# Altium schematic sheet DIO_buffer.schdoc
size 420 x 297 mm; EDA_Number: ARTIQ; Author: G.Kasprowicz; CompanyName: WUT ISE; DrawnBy: G.Kasprowicz; Organization: WUT ISE; DocumentNumber: 11; SheetNumber: 11; ModifiedBy: -; CheckedDate: -; Title2: DIO buffers; Designer: G.Kasprowicz; ModifiedDate: -; ProjectName: Sensor Box
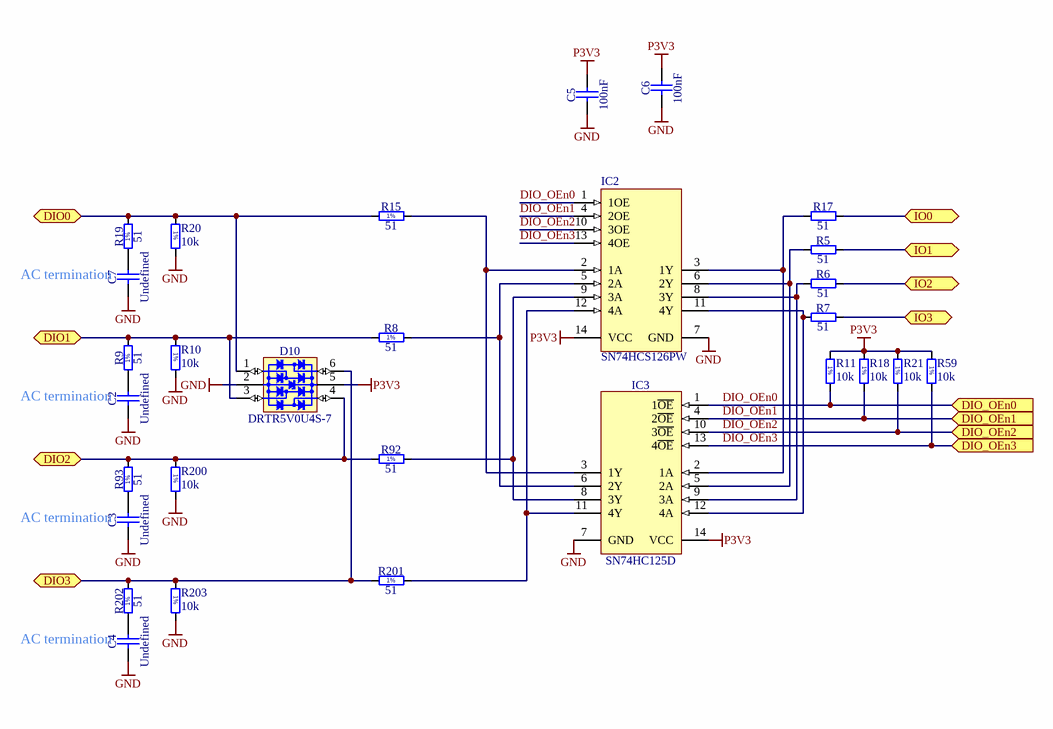
[diagram p0: DIO_buffer.schdoc]

## Parts
C2  Undefined  [CAPC1608X90N]
C3  Undefined  [CAPC1608X90N]
C4  Undefined  [CAPC1608X90N]
C5  100nF  [CAPC1005X55N]
C6  100nF  [CAPC1005X55N]
C7  Undefined  [CAPC1608X90N]
D10  DRTR5V0U4S-7  [SOT65P210X110-6N]
IC2  SN74HCS126PW  [SOP65P640X120-14N]
IC3  SN74HC125D  [SOIC127P600X175-14N]
R5  51  [RESC1005X40N]
R6  51  [RESC1005X40N]
R7  51  [RESC1005X40N]
R8  51  [RESC1005X40N]
R9  51  [RESC1005X40N]
R10  10k  [RESC1005X40N]
R11  10k  [RESC1005X40N]
R15  51  [RESC1005X40N]
R17  51  [RESC1005X40N]
R18  10k  [RESC1005X40N]
R19  51  [RESC1005X40N]
R20  10k  [RESC1005X40N]
R21  10k  [RESC1005X40N]
R59  10k  [RESC1005X40N]
R92  51  [RESC1005X40N]
R93  51  [RESC1005X40N]
R200  10k  [RESC1005X40N]
R201  51  [RESC1005X40N]
R202  51  [RESC1005X40N]
R203  10k  [RESC1005X40N]

## Ports
DIO0 (bidir), DIO1 (bidir), DIO2 (bidir), DIO3 (bidir), DIO_OEn0 (in), DIO_OEn1 (in), DIO_OEn2 (in), DIO_OEn3 (in), IO0 (bidir), IO1 (bidir), IO2 (bidir), IO3 (bidir)

## Nets
GND: C2.1 C3.1 C4.1 C5.1 C6.1 C7.1 D10.2(GND) IC2.7(GND) IC3.7(GND) R10.2 R20.2 R200.2 R203.2
P3V3: C5.2 C6.2 D10.5(VBUS) IC2.14(VCC) IC3.14(VCC) R11.1 R18.1 R21.1 R59.1
DIO0: D10.1(I/O1) R15.1 R19.2 R20.1 ; port DIO0
DIO1: D10.3(I/O2) R8.1 R9.2 R10.1 ; port DIO1
DIO2: D10.4(I/O3) R92.1 R93.2 R200.1 ; port DIO2
DIO3: D10.6(I/O4) R201.1 R202.2 R203.1 ; port DIO3
DIO_OEn0: IC2.1(1OE) IC3.1(1~{OE}) R11.2 ; port DIO_OEn0
DIO_OEn1: IC2.4(2OE) IC3.4(2~{OE}) R18.2 ; port DIO_OEn1
DIO_OEn2: IC2.10(3OE) IC3.10(3~{OE}) R21.2 ; port DIO_OEn2
DIO_OEn3: IC2.13(4OE) IC3.13(4~{OE}) R59.2 ; port DIO_OEn3
IO0: R17.2 ; port IO0
IO1: R5.2 ; port IO1
IO2: R6.2 ; port IO2
IO3: R7.2 ; port IO3
NetC2_2: C2.2 R9.1
NetC3_2: C3.2 R93.1
NetC4_2: C4.2 R202.1
NetC7_2: C7.2 R19.1
NetIC2_2: IC2.2(1A) IC3.3(1Y) R15.2
NetIC2_3: IC2.3(1Y) IC3.2(1A) R17.1
NetIC2_5: IC2.5(2A) IC3.6(2Y) R8.2
NetIC2_6: IC2.6(2Y) IC3.5(2A) R5.1
NetIC2_8: IC2.8(3Y) IC3.9(3A) R6.1
NetIC2_9: IC2.9(3A) IC3.8(3Y) R92.2
NetIC2_11: IC2.11(4Y) IC3.12(4A) R7.1
NetIC2_12: IC2.12(4A) IC3.11(4Y) R201.2

## Notes on the sheet
- (near C7) AC termination
- (near C2) AC termination
- (near C3) AC termination
- (near C4) AC termination
- Project/Equipment
- Document
- Designer
- Drawn by
- Check.by
- Copyright WUT =Copy(CurrentDate,7,4)
  This document describes Open Hardware and is licensed under the CERN-OHL-W v2
  You may redistribute and modify this documentation and make products using it under the terms of the CERN-OHL-W v2 (https:/cern.ch/cern-ohl). This documentation is distributed WITHOUT ANY EXPRESS OR IMPLIED WARRANTY, INCLUDING OF MERCHANTABILITY, SATISFACTORY QUALITY AND FITNESS FOR A PARTICULAR PURPOSE. Please see the CERN-OHL-W v2 for applicable conditions.
  Source location: =SourceLocation
  As per CERN-OHL-W v2 section 4, should You produce hardware based on these sources, You must maintain the Source Location visible on the silkscreen or top copper for a =Title1 PCB or other product you make using this documentation.
- Contact:
- File
- Last Mod.
- Print Date
- Sheet
- Size
- A3
- of
- Rev
- (in symbol R0402_10K_1%_0.0625W_100PPM) 1%
- (in symbol R0402_51R_1%_0.0625W_100PPM) 1%

## Library data of the parts
C2-C4 C7 = CC0603_NO-VALUE: Non-polarised capacitor; Part Description: Reserved Footprint For 0603(1608) Chip Ceramic Capacitor; Mounted: No; Part Number: CC0603_NO-VALUE; Component Kind: Standard; Component Type: Standard; Pin Count: 2; Value: Undefined; Status: None; Manufacturer: Undefined; Manufacturer Part Number: CC0603_NO-VALUE; Case: 0603; Socket: No; SMD: Yes; Sense: No; Manufacturer1 ComponentHeight: 0.9mm; HelpURL: Undefined; Author: CERN DEM MR; CreateDate: 22.11.2016; LatestRevisionDate: 22.11.2016
C5 C6 = CC0402_100NF_16V_10%_X5R: Non-polarised capacitor; Part Description: SMD Multilayer Chip Ceramic Capacitor; Manufacturer: GENERIC; Manufacturer1 Part Number: GRM155R61C104KA88D; Voltage: 16V; TC: X5R; Tolerance: ±10%; Part Number: CC0402_100NF_16V_10%_X5R; Component Kind: Standard; Component Type: Standard; Pin Count: 2; Value: 100nF; Status: None; Manufacturer Part Number: CC0402_100NF_16V_10%_X5R; Case: 0402; Mounted: Yes; Socket: No; SMD: Yes; Sense: No; Manufacturer1 Example: MURATA; Manufacturer1 ComponentHeight: 0.55mm; HelpURL: \\cern.ch\dfs\Applications\Altium\Datasheets\CC0402_X5R_MURATA_GRM.pdf; Author: CERN DEM JLC; CreateDate: 10.12.2013; LatestRevisionDate: 10.12.2013
D10 = D_TVS_DRTR5V0U4S-7: Integrated Quad Ultra-Low Capacitance ESD Protection; Part Description: Integrated Quad Ultra-Low Capacitance ESD (±8kV) Protection; Manufacturer: DIODES; PressFit: No; Bonding: No; Status Comment: Active; Part Number: DRTR5V0U4S-7; Component Kind: Standard; Component Type: Standard; Device: DRTR5V0U4S-7; PackageDescription: SOT363, SC70-6, 0.65mm Pitch; 6 Pin, 1.25mm W X 2.00mm L X 1.10mm H body, IPC Medium Density; Status: Active; Manufacturer Part Number: DRTR5V0U4S-7; Pin Count: 6; Case: SOT363; Mounted: Yes; Socket: No; SMD: Yes; Sense: No; ComponentHeight: 1.1mm; HelpURL: \\cern.ch\dfs\Applications\Altium\Datasheets\PRTR5V0U4Y.pdf; Author: GK; CreateDate: 24.01.2017; LatestRevisionDate: 14.09.2020
IC2 = SN74HCS126PW: Quadruple Bus Buffer with 3-State Outputs; Part Description: Quadruple Buffer with 3-State Outputs and Schmitt-Trigger Inputs; Manufacturer: TEXAS INSTRUMENTS; PressFit: No; Bonding: No; Part Number: SN74HCS126PW; Component Kind: Standard; Component Type: Standard; Device: SN74HCS126PW; PackageDescription: SOP, 0.65mm Pitch; 14 Pin, 4.40mm W X 5.00mm L X 1.20mm H body, IPC Medium Density; Manufacturer Part Number: SN74HCS126PW; Pin Count: 14; Case: TSSOP14; Mounted: Yes; Socket: No; SMD: Yes; Sense: No; ComponentHeight: 1.2mm; Author: CERN DEM BC; HelpURL: \\cern.ch\dfs\Applications\Altium\Datasheets\SN74HCS126PW.pdf; CreateDate: 08.12.2020; LatestRevisionDate: 08.12.2020
IC3 = SN74HC125D: Quadruple Bus Buffer with 3-State Outputs; Manufacturer: TEXAS INSTRUMENTS; PressFit: No; Bonding: No; Part Number: SN74HC125D; Component Kind: Standard; Component Type: Standard; Device: SN74HC125D; PackageDescription: SOIC 14, Pitch 1.27mm - Body 4x8.75mm, IPC Medium Density; Part Description: Quadruple Bus Buffer with 3-State Outputs; Manufacturer Part Number: SN74HC125D; Pin Count: 14; Case: SOIC14; Mounted: Yes; Socket: No; SMD: Yes; Sense: No; ComponentHeight: 1.75mm; Author: CERN DEM JLC; HelpURL: \\cern.ch\dfs\Applications\Altium\Datasheets\SN74HC125D.pdf; CreateDate: 30.06.2011; LatestRevisionDate: 30.06.2011
R5-R9 R15 R17 R19 R92 R93 R201 R202 = R0402_51R_1%_0.0625W_100PPM: Resistor - 1%; Part Description: General Purpose Thick Film Chip Resistor; Manufacturer: GENERIC; Manufacturer1 Part Number: 232270675109L; TC: ±100ppm/°C; PressFit: No; Part Number: R0402_51R_1%_0.0625W_100PPM; Component Kind: Standard; Component Type: Standard; Pin Count: 2; Value: 51; Status: Not Recommended; Power: 0.0625W; Tolerance: ±1%; Manufacturer Part Number: R0402_51R_1%_0.0625W_100PPM; Case: 0402; Mounted: Yes; Sense: No; Socket: No; SMD: Yes; Manufacturer1 Example: YAGEO PHYCOMP; Manufacturer1 ComponentHeight: 0.4mm; HelpURL: \\cern.ch\dfs\Applications\Altium\Datasheets\R0402_Phycomp_RC0402.pdf; Author: CERN DEM JLC
  R5-R7 R17: CreateDate: 03.12.2007; LatestRevisionDate: 17.10.2012
  R8 R9 R15 R19 R92 R93 R201 R202: CreateDate: 03/12/2007; LatestRevisionDate: 17/10/2012
R10 R11 R18 R20 R21 R59 R200 R203 = R0402_10K_1%_0.0625W_100PPM: Resistor - 1%; Part Description: General Purpose Thick Film Chip Resistor; Manufacturer: GENERIC; Manufacturer1 Part Number: 232270671003L; TC: ±100ppm/°C; Part Number: R0402_10K_1%_0.0625W_100PPM; Component Kind: Standard; Component Type: Standard; Pin Count: 2; Value: 10k; Status: Not recommended; Power: 0.0625W; Tolerance: ±1%; Manufacturer Part Number: R0402_10K_1%_0.0625W_100PPM; Case: 0402; Mounted: Yes; Sense: No; Socket: No; SMD: Yes; Manufacturer1 Example: YAGEO PHYCOMP; Manufacturer1 ComponentHeight: 0.4mm; HelpURL: \\cern.ch\dfs\Applications\Altium\Datasheets\R0402_Phycomp_RC0402.pdf; Author: CERN DEM JLC; CreateDate: 03.12.2007; LatestRevisionDate: 17.10.2012